# Altium schematic sheet Sheet2-USB.SchDoc
size A4; SheetNumber: 3; SheetTotal: 6
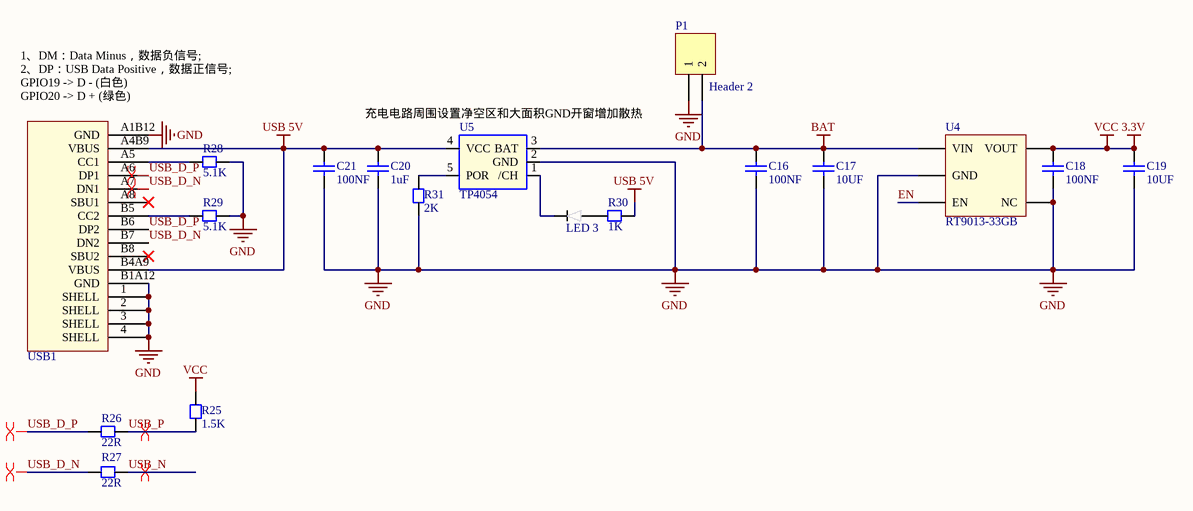
[diagram p0: Sheet2-USB.SchDoc]

## Parts
C16  100NF  [CC1608-0603]
C17  10UF  [CC1608-0603]
C18  100NF  [CC1608-0603]
C19  10UF  [CC1608-0603]
C20  1uF  [CC1608-0603]
C21  100NF  [CC1608-0603]
LED_3  LED 0603  [LED 0603]  (value not drawn)
P1  Header 2  [HX2.54-2]
R25  1.5K  [CR1608-0603]
R26  22R  [CR1608-0603]
R27  22R  [CR1608-0603]
R28  5.1K  [CR1608-0603]
R29  5.1K  [CR1608-0603]
R30  1K  [CR1608-0603]
R31  2K  [CR1608-0603]
U4  RT9013-33GB  [SOT23-5]
U5  TP4054  [SOT23-5]
USB1  Tpye-c 16P  [TYPE-C 16P]  (value not drawn)

## Nets
3.3V: C18.2 C19.2 R25.1 U4.5(VOUT)  [also labelled VCC]
BAT: C16.2 C17.2 P1.2 U4.1(VIN) U5.3(BAT)
GND: C16.1 C17.1 C18.1 C19.1 C20.1 C21.1 P1.1 R28.1 R29.1 R31.2 U4.2(GND) U4.4(NC) U5.2(GND) USB1.1(SHELL) USB1.2(SHELL) USB1.3(SHELL) USB1.4(SHELL) USB1.A1B12(GND) USB1.B1A12(GND)
USB 5V: C20.2 C21.2 R30.1 U5.4(VCC) USB1.A4B9(VBUS) USB1.B4A9(VBUS)
EN: U4.3(EN)
USB_D_N: R27.2 USB1.A7(DN1) USB1.B7(DN2)
USB_D_P: R26.2 USB1.A6(DP1) USB1.B6(DP2)
USB_N: R27.1
USB_P: R25.2 R26.1
NetLED_3_1: LED_3.1 R30.2
NetLED_3_2: LED_3.2 U5.1(/CH)
NetR28_2: R28.2 USB1.A5(CC1)
NetR29_2: R29.2 USB1.B5(CC2)
NetR31_1: R31.1 U5.5(POR)

Not connected (* = marked no-connect by the designer): USB1 A8(SBU1)* B8(SBU2)*

## Layout directives
differential pair: USB_D_N, USB_D_P, USB_N, USB_P

## Notes on the sheet
- (near USB1) 1、DM：Data Minus，数据负信号;
  2、DP：USB Data Positive，数据正信号;
  GPIO19 -> D - (白色)
  GPIO20 -> D + (绿色)
- 充电电路周围设置净空区和大面积GND开窗增加散热

## Library data of the parts
C16-C21 = Cap Chip 0603: 0603封装的电容; Published: 8-Jun-2000; Revision: July-2002: Re-released for DXP Platform.; Publisher: Altium Limited
P1 = Header 2: Header, 2-Pin; LatestRevisionDate: 17-Jul-2002; LatestRevisionNote: Re-released for DXP Platform.; Publisher: Altium Limited
R25-R31 = Resistor Chip 0603: 0603封装电阻; Published: 8-Jun-2000; Revision: July-2002: Re-released for DXP Platform.; Publisher: Altium Limited
U4 = RT9013-33GB: LDO 2.2-5.2V IN 500Ma OUT SOT23-5
U5 = TP4054: 迷你充电IC SOT-23-5
USB1 = Tpye-c 16P: 16P 封装的TYPE -c接口 4固定插脚 双向